# EAGLE design LCDDisplay (EAGLE 6.3)
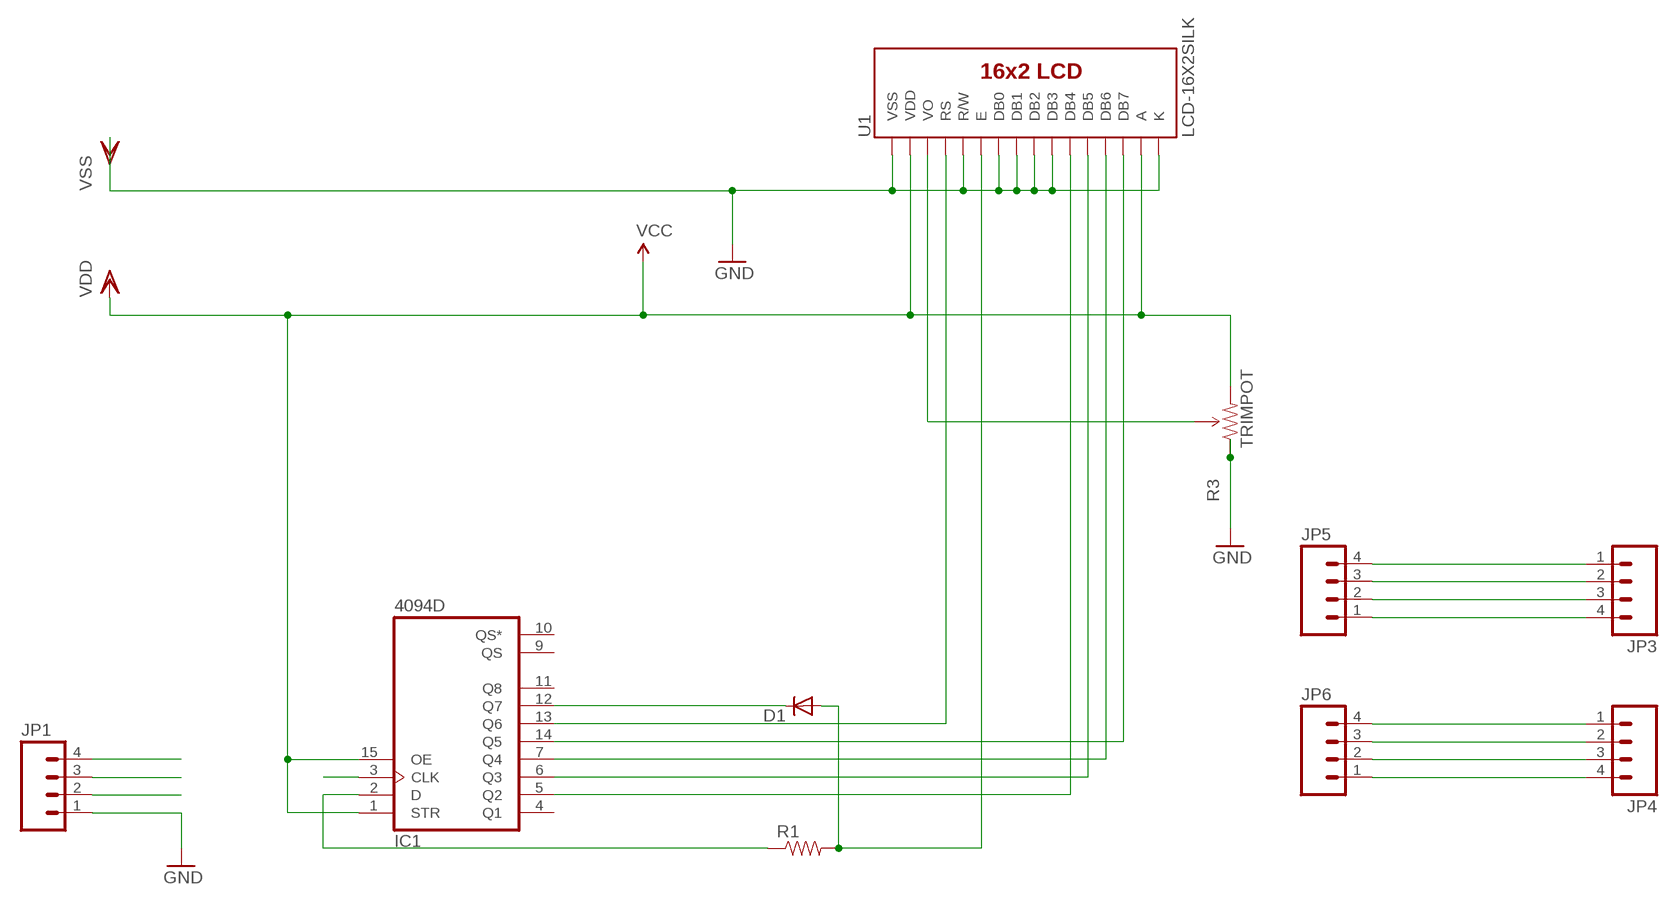
[diagram p0: schematic, sheet 1]

## Parts
D1  DIODE1N4148  [DIODE-1N4148]
IC1  4094D  [SO16]
JP1  M04PTH  [1X04]
JP3  M041.27MM  [1X04-1.27MM]
JP4  M041.27MM  [1X04-1.27MM]
JP5  M04LOCK_LONGPADS  [1X04_LOCK_LONGPADS]
JP6  M04LOCK_LONGPADS  [1X04_LOCK_LONGPADS]
R1  RESISTORAXIAL-0.3  [AXIAL-0.3]
R3  TRIMPOT  [3362U-2]
U1  LCD-16X2SILK  [LCD-16X2]

## Nets
CLK: IC1.3(CLK) JP1.3
DATA: IC1.2(D) JP1.4 R1.P$1
GND: JP1.1 R3.1(CCW) U1.1(VSS) U1.5(R/W) U1.7(DB0) U1.8(DB1) U1.9(DB2) U1.10(DB3) U1.16(K) ; supply symbol labelled VSS
N$1: IC1.13(Q6) U1.4(RS)
N$2: D1.A R1.P$2 U1.6(E)
N$3: R3.2(WIPER) U1.3(VO)
N$4: D1.C IC1.12(Q7)
N$5: JP3.1 JP5.4
N$6: IC1.5(Q2) U1.11(DB4)
N$7: IC1.6(Q3) U1.12(DB5)
N$8: JP3.2 JP5.3
N$9: IC1.7(Q4) U1.13(DB6)
N$10: IC1.14(Q5) U1.14(DB7)
N$11: JP3.3 JP5.2
N$12: JP3.4 JP5.1
N$13: JP4.1 JP6.4
N$14: JP4.2 JP6.3
N$15: JP4.3 JP6.2
N$16: JP4.4 JP6.1
VDD: IC1.1(STR) IC1.15(OE) JP1.2 R3.3(CW) U1.2(VDD) U1.15(A) ; supply symbol labelled VCC
Unconnected: IC1.4(Q1) IC1.9(QS) IC1.10(QS*) IC1.11(Q8)

## Power pins joined to a net without a drawn wire
GND: IC1.8(VSS)
VDD: IC1.16(VDD)

## Library data of the parts
D1 = SparkFun:DIODE: Diode These are standard reverse protection diodes and small signal diodes. SMA package can handle up to about 1A. SOD-323 can handle about 200mA. What the SOD-323 package when ordering, there are some mfgs out there that are 5-pin packages.
IC1 = 40xx:4094: 8-stage SHIFT/STORE REGISTER, tri-state
JP1 JP5 JP6 = SparkFun:M04: Header 4 Standard 4-pin 0.1" header. Use with straight break away headers (SKU : PRT-00116), right angle break away headers (PRT-00553), swiss pins (PRT-00743), machine pins (PRT-00117), and female headers (PRT-00115). Molex polarized connector foot print use with SKU : PRT-08231 with associated crimp pins and housings. 1MM SMD Version SKU: PRT-10208
JP3 JP4 = SparkFun-Connectors:M04: Header 4 Standard 4-pin 0.1" header. Use with straight break away headers (SKU : PRT-00116), right angle break away headers (PRT-00553), swiss pins (PRT-00743), machine pins (PRT-00117), and female headers (PRT-00115). Molex polarized connector foot print use with SKU : PRT-08231 with associated crimp pins and housings. 1MM SMD Version SKU: PRT-10208
R1 = SparkFun:RESISTOR: Resistor Basic schematic elements and footprints for 0603, 1206, and PTH resistors.
R3 = SparkFun:TRIMPOT
U1 = SparkFun:LCD-16X2

## Board
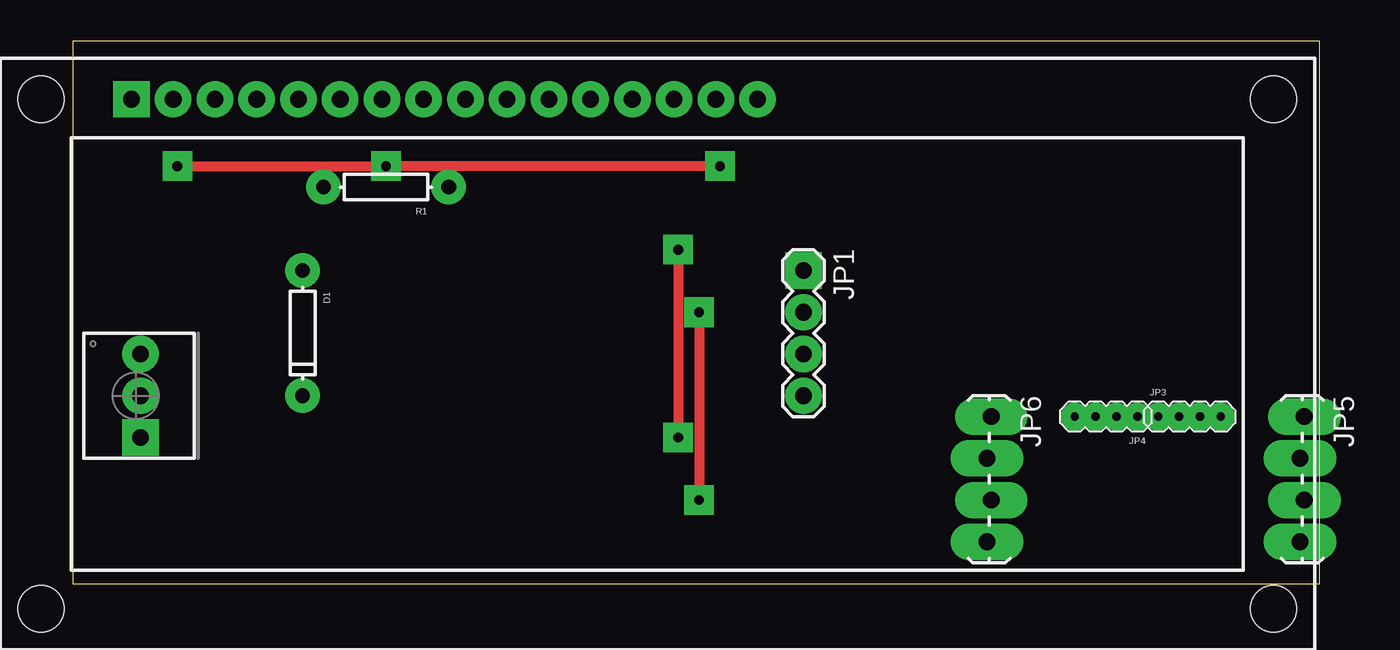
[diagram p1: board, top side]
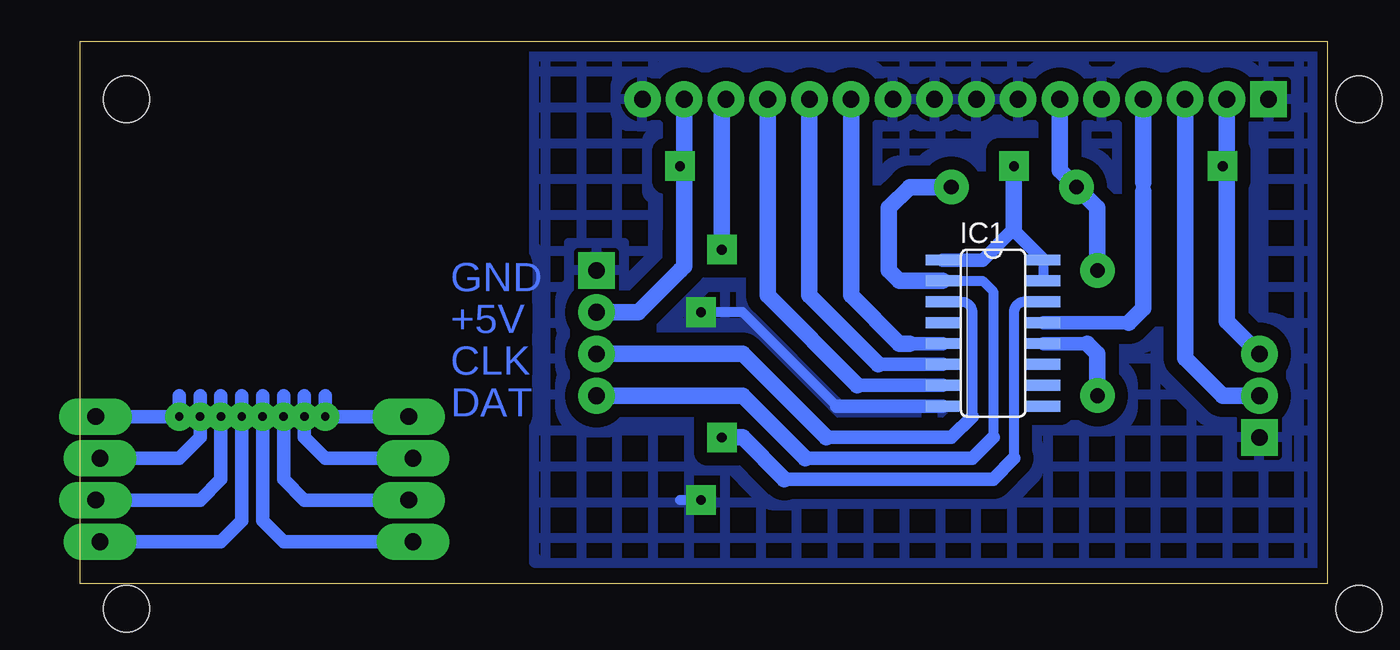
[diagram p2: board, bottom side, seen from below]

Size 75.88 x 33.02 mm. Coordinates in mm from the lower left corner, seen from the top.
Outline: 0,0.01 75.88,0 75.87,33.02 0,33.02 0,0.01
Copper layers (1*16): Top 0.035mm / dielectric 1.5mm / Bottom 0.035mm
Design rules "hobby": minimum track width 0.8mm, minimum drill 0.8mm, track to track 0.8mm, track to pad 0.8mm, pad to pad 0.45mm, via to via 0.8mm, smd to smd 8mil, copper to edge 10mil, drill to drill 8mil, minimum pad ring 0.6mm, minimum via ring 0.6mm, stop-mask expansion 0mil, vias tented up to drill 0mil, thermal gap 10mil

### Footprints (pad centres in the part's own frame; a part is rotated, then mirrored left to right if it is on the bottom)
DIODE-1N4148 = drill 0.9 pad 1.88: A -3.81,0; C 3.81,0
SO16 = smd 0.66 x 2.032: 1 -4.445,-3.073; 2 -3.175,-3.073; 3 -1.905,-3.073; 4 -0.635,-3.073; 5 0.635,-3.073; 6 1.905,-3.073; 7 3.175,-3.073; 8 4.445,-3.073; 9 4.445,3.073; 10 3.175,3.073; 11 1.905,3.073; 12 0.635,3.073; 13 -0.635,3.073; 14 -1.905,3.073; 15 -3.175,3.073; 16 -4.445,3.073
1X04 = drill 1.016 pad 1.88 square: 1 0,0 | drill 1.016 pad 1.88: 2 2.54,0; 3 5.08,0; 4 7.62,0
1X04-1.27MM = drill 0.508 pad 1: 1 0,0; 2 1.27,0; 3 2.54,0; 4 3.81,0
1X04_LOCK_LONGPADS = drill 1.016 long: 1 0,0; 2 2.54,-0.254; 3 5.08,0; 4 7.62,-0.254
AXIAL-0.3 = drill 0.9 pad 1.88: P$1 -3.81,0; P$2 3.81,0
3362U-2 = drill 1.016 pad 1.88 square: 1 -2.54,-0.305 | drill 1.016 pad 1.88: 2 0,-0.305; 3 2.54,-0.305
LCD-16X2 = drill 1.016 pad 1.88 square: 1 -32,15.5 | drill 1.016 pad 1.88: 2 -29.46,15.5; 3 -26.92,15.5; 4 -24.38,15.5; 5 -21.84,15.5; 6 -19.3,15.5; 7 -16.76,15.5; 8 -14.22,15.5; 9 -11.68,15.5; 10 -9.14,15.5; 11 -6.6,15.5; 12 -4.06,15.5; 13 -1.52,15.5; 14 1.02,15.5; 15 3.56,15.5; 16 6.1,15.5 | hole 2.8: -37.5,15.5; -37.5,-15.5; 37.5,15.5; 37.5,-15.5

### Placement (x,y rotation side)
D1  13.97,15.25 270 top
IC1  20.32,15.25 270 bottom
JP1  44.45,19.06 270 top
JP3  66.04,10.17 0 top
JP4  64.77,10.17 180 top
JP5  74.93,10.17 270 top
JP6  55.88,10.17 270 top
R1  19.05,24.14 180 top
R3  3.81,11.44 90 top
U1  35.56,13.98 0 top

### Tracks (layer width: path | path; a pad name or v marks a point on that pad's centre or on a via)
CLK
  Bottom 0.61: IC1.3 22.23,17.16 arc90 21.59,16.52 21.59,10.17
  Bottom 0.813: 30.48,8.9 22.86,8.9 21.59,10.17
  Bottom 1.016: JP1.3 35.56,13.98 30.48,8.9
DATA
  Bottom 0.61: IC1.2 20.95,18.43 20.32,17.79 20.32,8.9
  Bottom 0.813: 20.32,8.9 21.59,7.63 31.75,7.63
  Bottom 1.016: JP1.4 35.56,11.44 31.75,7.63 | R1.P$1 25.4,24.14 26.67,22.87 26.67,19.06 26.04,18.43 IC1.2
GND  (via drill 0.6)
  Top 0.61: v38.1,16.52 v38.1,5.09
  Bottom 0.61: 29.84,10.81 35.56,16.52 v38.1,16.52 | v38.1,5.09 39.37,5.09
  Bottom 0.813: IC1.8 29.84,10.81
  pour Bottom (isolate 0.61, rank 2, hatched): 0,1.28 0,33.03 48.26,33.03 48.26,1.28
N$1
  Bottom 0.61: 11.18,24.39 11.18,23.89
  Bottom 0.813: 12.07,15.89 IC1.13
  Bottom 1.016: U1.4 11.18,24.39 | 11.18,23.89 11.18,16.77 12.07,15.89
N$2
  Bottom 1.016: U1.6 16.26,25.16 R1.P$2 13.97,22.87 D1.A
N$3
  Bottom 1.016: R3.2 6.35,11.44 8.64,13.73 U1.3
N$4
  Bottom 0.813: IC1.12 14.61,14.62
  Bottom 1.016: 14.61,14.62 13.97,13.98 D1.C
N$5
  Bottom 0.813: JP5.4 67.31,2.55 66.04,3.82 JP3.1 66.04,11.44
N$6
  Bottom 0.813: IC1.5 25.4,14.62
  Bottom 1.016: U1.11 28.96,17.54 26.04,14.62 25.4,14.62
N$7
  Bottom 0.813: IC1.6 27.3,13.35
  Bottom 1.016: 27.3,13.35 31.5,17.54 U1.12
N$8
  Bottom 0.813: JP5.3 68.58,5.09 67.31,6.36 JP3.2 67.31,11.44
N$9
  Bottom 0.813: IC1.7 28.58,12.08
  Bottom 1.016: 28.58,12.08 34.04,17.54 U1.13
N$10  (via drill 0.6)
  Top 0.61: v36.83,20.33 v36.83,8.9
  Bottom 0.61: IC1.14 18.41,17.16 arc-90 19.05,16.52 19.05,7.63 | U1.14 36.83,29.48
  Bottom 0.813: 19.05,7.63 20.32,6.36 33.02,6.36
  Bottom 1.016: 33.02,6.36 35.56,8.9 v36.83,8.9 | 36.83,29.48 v36.83,20.33
N$11
  Bottom 0.813: JP5.2 69.85,7.63 68.58,8.9 JP3.3 68.58,11.44
N$12
  Bottom 0.813: JP5.1 JP3.4 69.85,11.44
N$13
  Bottom 0.813: JP6.4 63.5,2.55 64.77,3.82 JP4.1 64.77,11.44
N$14
  Bottom 0.813: JP6.3 62.23,5.09 63.5,6.36 JP4.2 63.5,11.44
N$15
  Bottom 0.813: 62.23,11.44 JP4.3 62.23,8.9 60.96,7.63 JP6.2
N$16
  Bottom 0.813: JP6.1 JP4.4 60.96,11.44
VDD  (via drill 0.6)
  Top 0.61: v39.37,25.41 v19.05,25.41 v6.35,25.41
  Bottom 0.61: 39.12,19.31 arc90 39.37,19.06 | IC1.15 IC1.16 | 39.12,21.35 v39.37,25.41 | 6.1,15.97 6.1,21.35 v6.35,25.41
  Bottom 0.813: IC1.16 19.05,21.5 19.05,21.6 20.95,19.7 IC1.1
  Bottom 1.016: U1.2 6.1,15.97 R3.3 | U1.15 39.12,21.35 39.12,19.31 | 39.37,19.06 41.91,16.52 JP1.2 | v19.05,25.41 19.05,21.6

### Text on the board
Bottom: GND | +5V | CLK | DAT